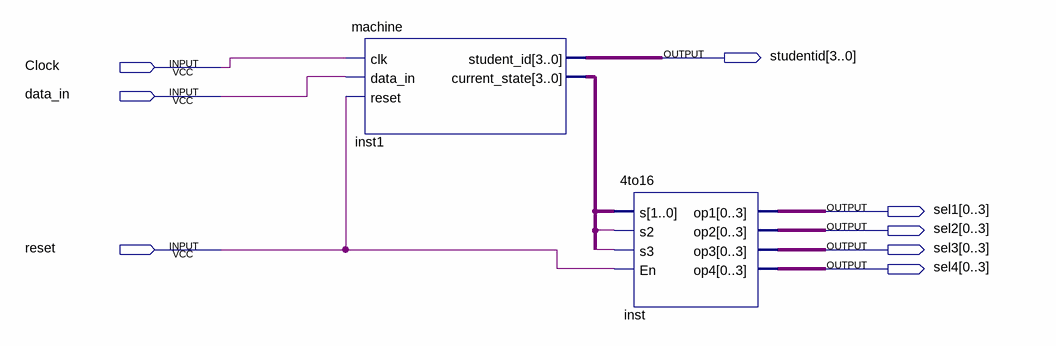
[diagram p0: schematic sheet]
// Quartus schematic controlUnit.bdf as structural Verilog: 2 symbols, 8 pins
module controlUnit (
  input  Clock,
  input  data_in,
  input  reset,
  output [3:0] studentid,
  output [0:3] sel1,
  output [0:3] sel2,
  output [0:3] sel3,
  output [0:3] sel4
);

  wire undriven, undriven_2;
  wire [3:0] inst1_current_state;

  machine inst1 (
    .clk(Clock), .data_in(data_in), .reset(reset), .student_id(studentid), .current_state(inst1_current_state));
  \4to16  inst (
    .s(inst1_current_state), .s2(undriven), .s3(undriven_2), .En(reset), .op1(sel1), .op2(sel2), .op3(sel3),
    .op4(sel4));
endmodule
